# Altium schematic sheet can.SchDoc
size 203 x 139 mm; SheetNumber: 6; SheetTotal: 6
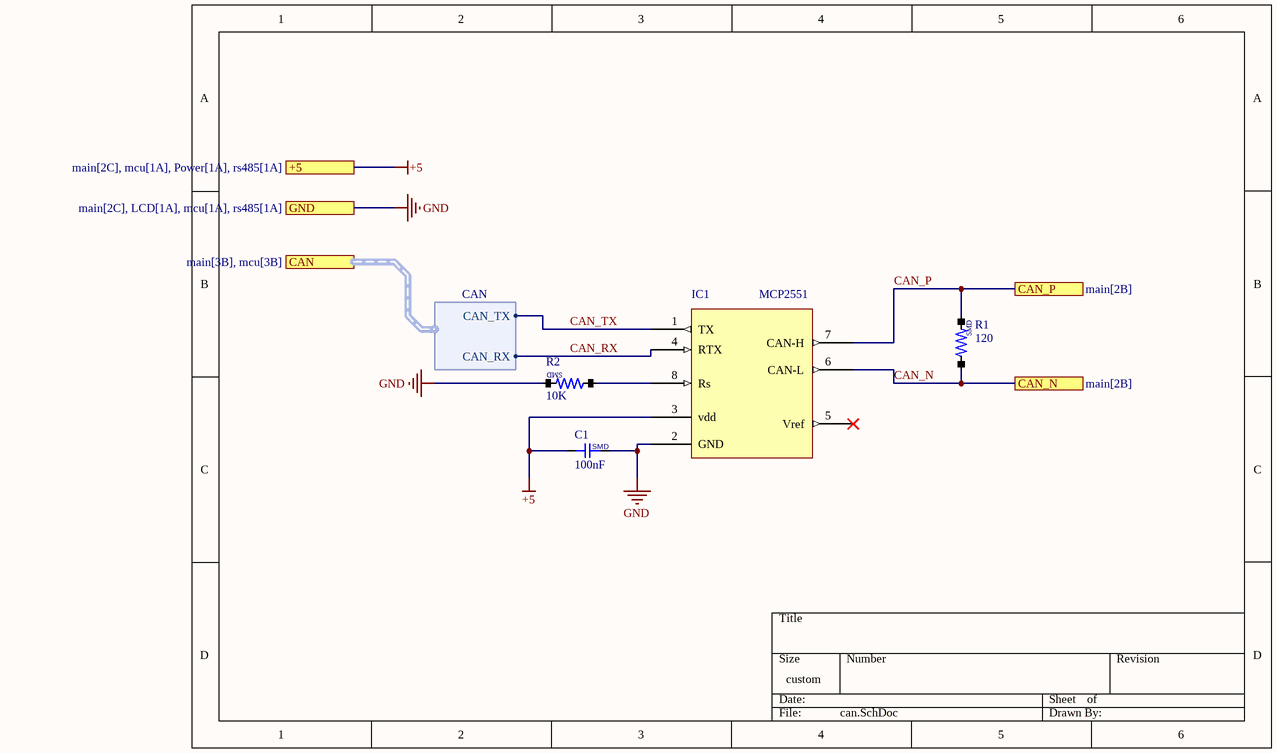
[diagram p0: can.SchDoc]

## Parts
C1  100nF  [CAP-0603]
IC1  MCP2551  [SOP-8]
R1  120  [RES/1206]
R2  10K  [RES/0603]

## Ports
+5 (see main[2C], mcu[1A], Power[1A], rs485[1A]), CAN (harness CAN, see main[3B], mcu[3B]), CAN_N (see main[2B]), CAN_P (see main[2B]), GND (see main[2C], LCD[1A], mcu[1A], rs485[1A])

## Harnesses
CAN: CAN_RX, CAN_TX

## Nets
+5: C1.1 IC1.3(vdd) ; port +5
GND: C1.2 IC1.2(GND) R2.2 ; port GND
CAN_N: IC1.6(CAN-L) R1.1 ; port CAN_N
CAN_P: IC1.7(CAN-H) R1.2 ; port CAN_P
CAN_RX: IC1.4(RTX) ; port CAN.CAN_RX
CAN_TX: IC1.1(TX) ; port CAN.CAN_TX
NetIC1_8: IC1.8(Rs) R2.1

Not connected (* = marked no-connect by the designer): IC1 5(Vref)*

## Notes on the sheet
- (in symbol cap_smd) SMD
- (in symbol RES/SMD) SMD

## Library data of the parts
C1 = cap_smd
R1 R2 = RES/SMD